# Altium schematic sheet 36.SchDoc
size 594 x 420 mm; Scale: 1:1; Обозначение документа: ГУИР.203719.145 Э3; Номер листа: 28; Общее количество листов: 28
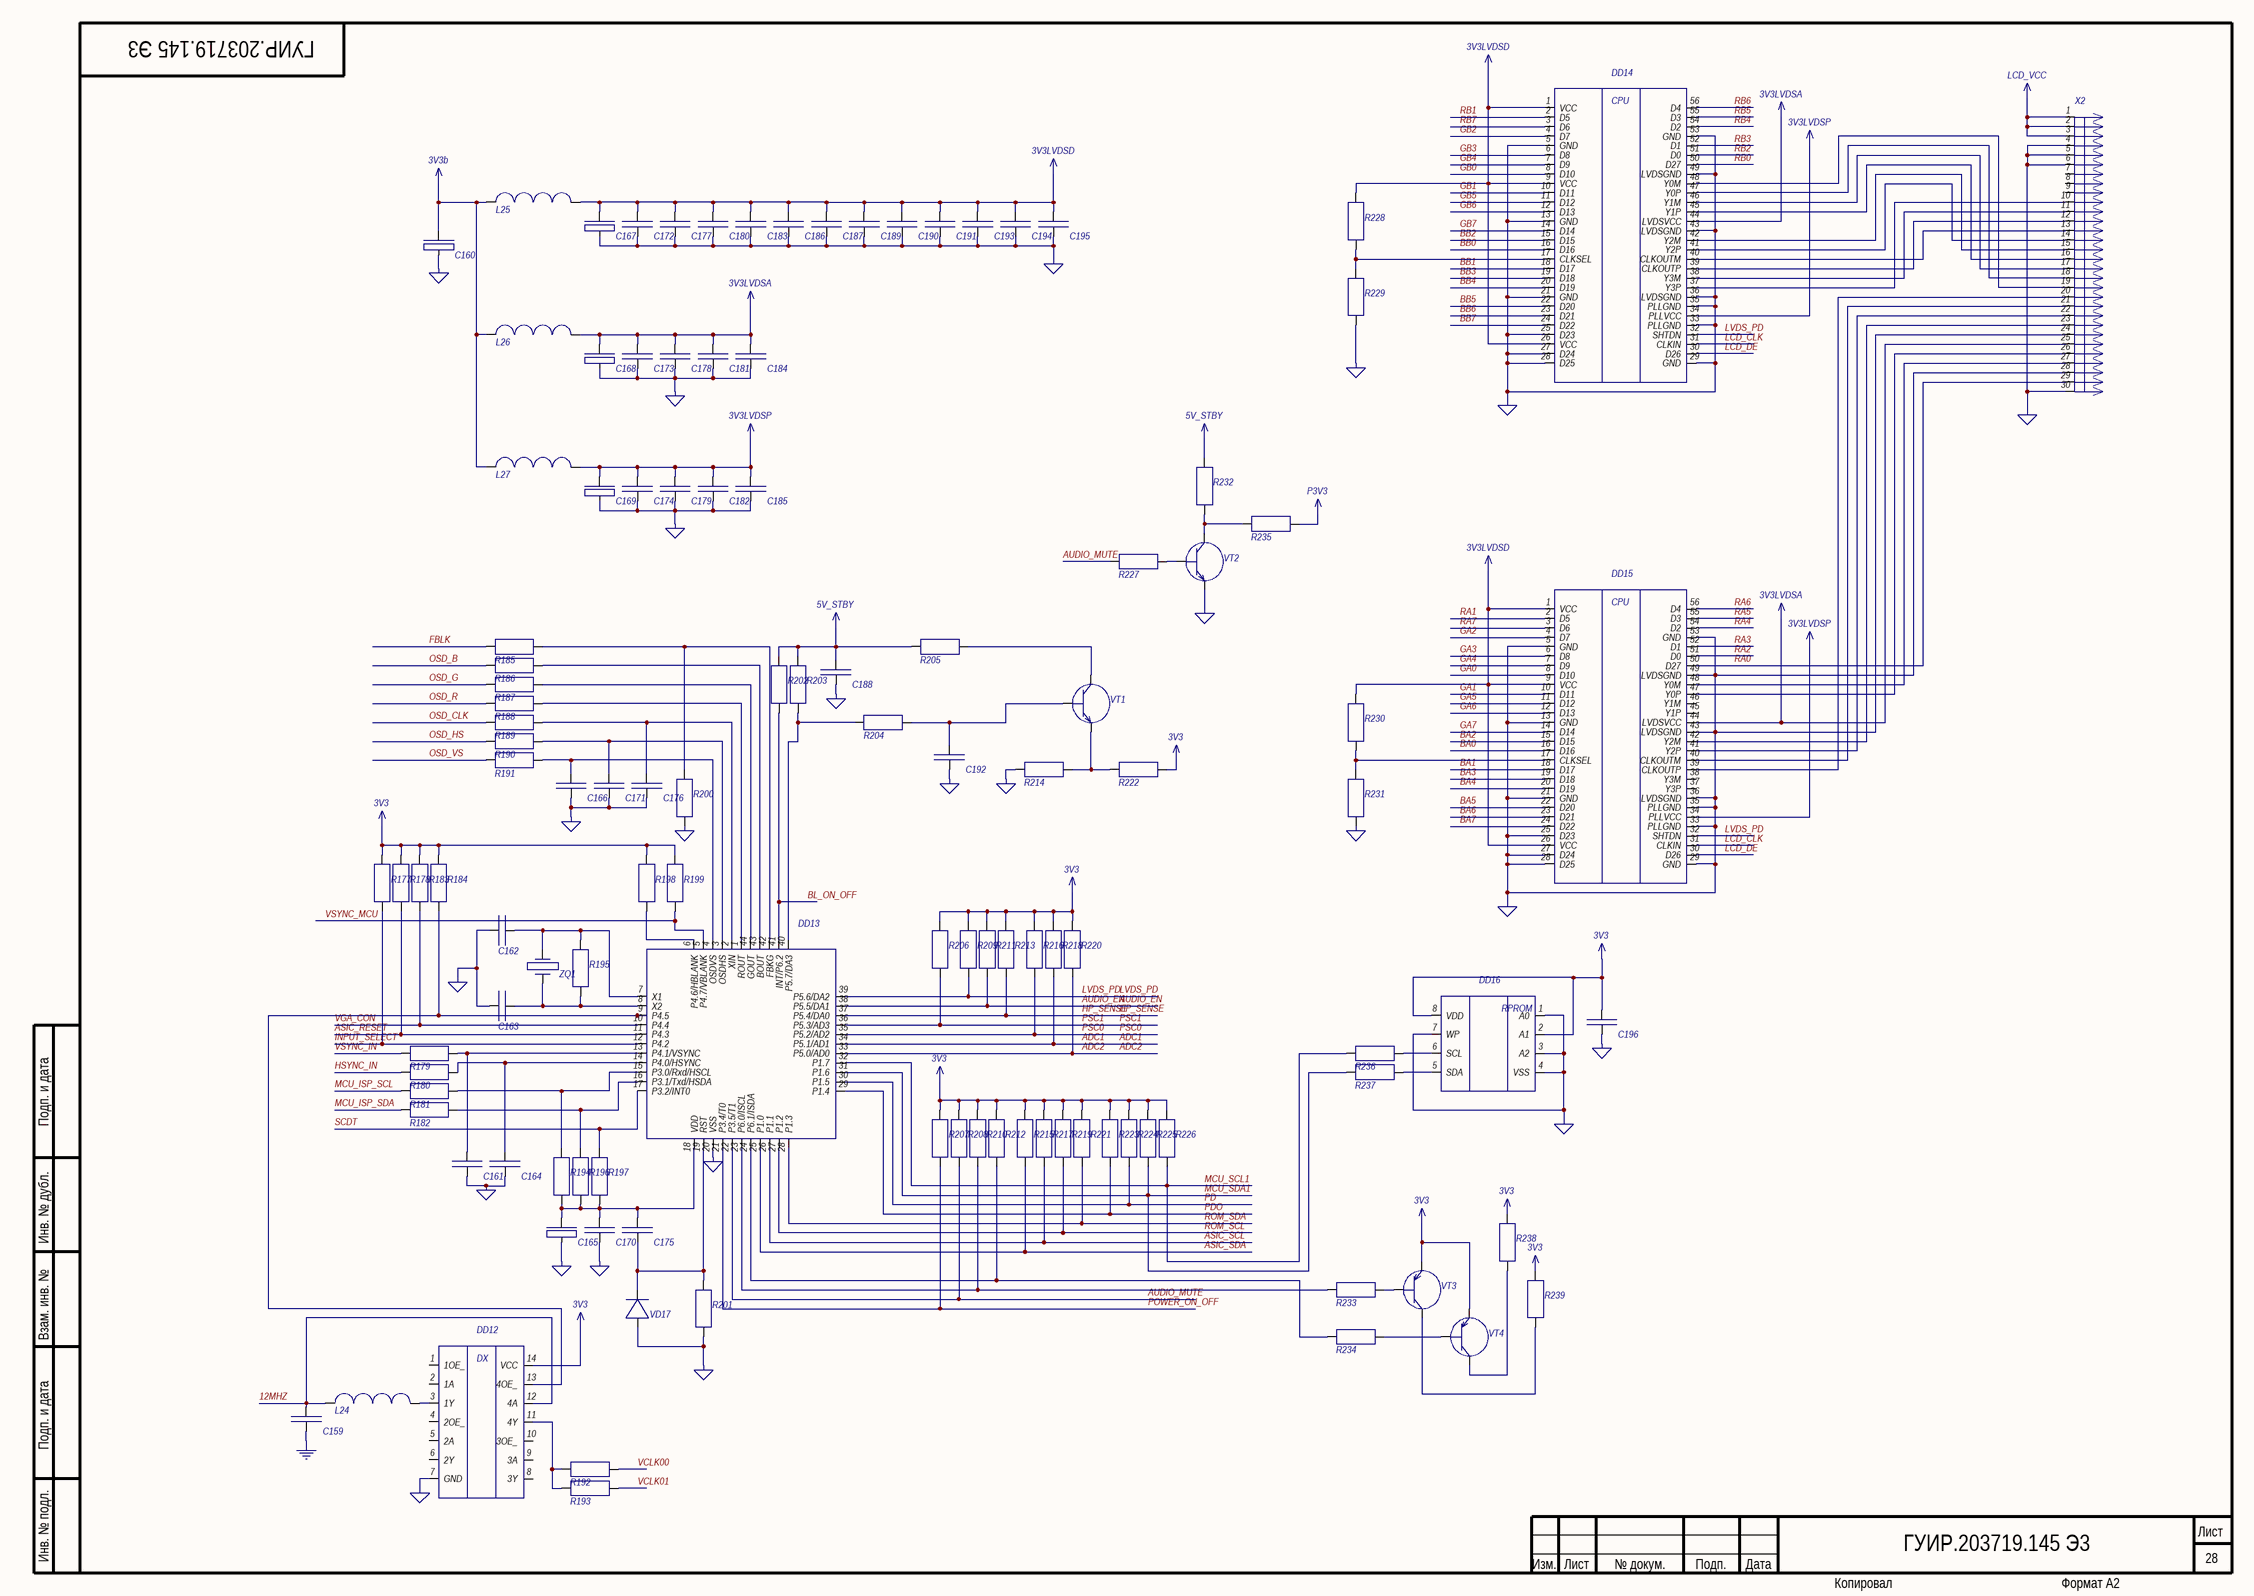
[diagram p0: 36.SchDoc]

## Parts
C159  Capacitor  [cap_electro_13]  (value not drawn)
C160  TuningCapacitor  [Cap_tantal_D]  (value not drawn)
C161  Capacitor  [cap_electro_13]  (value not drawn)
C162  Capacitor  [cap_electro_13]  (value not drawn)
C163  Capacitor  [cap_electro_13]  (value not drawn)
C164  Capacitor  [cap_electro_13]  (value not drawn)
C165  TuningCapacitor  [Cap_tantal_D]  (value not drawn)
C166  Capacitor  [cap_electro_13]  (value not drawn)
C167  TuningCapacitor  [Cap_tantal_D]  (value not drawn)
C168  TuningCapacitor  [Cap_tantal_D]  (value not drawn)
C169  TuningCapacitor  [Cap_tantal_D]  (value not drawn)
C170  Capacitor  [cap_electro_13]  (value not drawn)
C171  Capacitor  [cap_electro_13]  (value not drawn)
C172  Capacitor  [cap_electro_13]  (value not drawn)
C173  Capacitor  [cap_electro_13]  (value not drawn)
C174  Capacitor  [cap_electro_13]  (value not drawn)
C175  Capacitor  [cap_electro_13]  (value not drawn)
C176  Capacitor  [cap_electro_13]  (value not drawn)
C177  Capacitor  [cap_electro_13]  (value not drawn)
C178  Capacitor  [cap_electro_13]  (value not drawn)
C179  Capacitor  [cap_electro_13]  (value not drawn)
C180  Capacitor  [cap_electro_13]  (value not drawn)
C181  Capacitor  [cap_electro_13]  (value not drawn)
C182  Capacitor  [cap_electro_13]  (value not drawn)
C183  Capacitor  [cap_electro_13]  (value not drawn)
C184  Capacitor  [cap_electro_13]  (value not drawn)
C185  Capacitor  [cap_electro_13]  (value not drawn)
C186  Capacitor  [cap_electro_13]  (value not drawn)
C187  Capacitor  [cap_electro_13]  (value not drawn)
C188  Capacitor  [cap_electro_13]  (value not drawn)
C189  Capacitor  [cap_electro_13]  (value not drawn)
C190  Capacitor  [cap_electro_13]  (value not drawn)
C191  Capacitor  [cap_electro_13]  (value not drawn)
C192  Capacitor  [cap_electro_13]  (value not drawn)
C193  Capacitor  [cap_electro_13]  (value not drawn)
C194  Capacitor  [cap_electro_13]  (value not drawn)
C195  Capacitor  [cap_electro_13]  (value not drawn)
C196  Capacitor  [cap_electro_13]  (value not drawn)
DD12  74LCX125  [74LCX125(page12)]  (value not drawn)
DD13  SM0230  [SM0230]  (value not drawn)
DD14  SN75LVDS83  [SN75LVDS83_v2]  (value not drawn)
DD15  SN75LVDS83  [SN75LVDS83_v2]  (value not drawn)
DD16  24LC16  [24Cxx]  (value not drawn)
L24  Inductor  [inductor]  (value not drawn)
L25  Inductor  [inductor]  (value not drawn)
L26  Inductor  [inductor]  (value not drawn)
L27  Inductor  [inductor]  (value not drawn)
R177  Resistor  [R_1206]  (value not drawn)
R178  Resistor  [R_1206]  (value not drawn)
R179  Resistor  [R_1206]  (value not drawn)
R180  Resistor  [R_1206]  (value not drawn)
R181  Resistor  [R_1206]  (value not drawn)
R182  Resistor  [R_1206]  (value not drawn)
R183  Resistor  [R_1206]  (value not drawn)
R184  Resistor  [R_1206]  (value not drawn)
R185  Resistor  [R_1206]  (value not drawn)
R186  Resistor  [R_1206]  (value not drawn)
R187  Resistor  [R_1206]  (value not drawn)
R188  Resistor  [R_1206]  (value not drawn)
R189  Resistor  [R_1206]  (value not drawn)
R190  Resistor  [R_1206]  (value not drawn)
R191  Resistor  [R_1206]  (value not drawn)
R192  Resistor  [R_1206]  (value not drawn)
R193  Resistor  [R_1206]  (value not drawn)
R194  Resistor  [R_1206]  (value not drawn)
R195  Resistor  [R_1206]  (value not drawn)
R196  Resistor  [R_1206]  (value not drawn)
R197  Resistor  [R_1206]  (value not drawn)
R198  Resistor  [R_1206]  (value not drawn)
R199  Resistor  [R_1206]  (value not drawn)
R200  Resistor  [R_1206]  (value not drawn)
R201  Resistor  [R_1206]  (value not drawn)
R202  Resistor  [R_1206]  (value not drawn)
R203  Resistor  [R_1206]  (value not drawn)
R204  Resistor  [R_1206]  (value not drawn)
R205  Resistor  [R_1206]  (value not drawn)
R206  Resistor  [R_1206]  (value not drawn)
R207  Resistor  [R_1206]  (value not drawn)
R208  Resistor  [R_1206]  (value not drawn)
R209  Resistor  [R_1206]  (value not drawn)
R210  Resistor  [R_1206]  (value not drawn)
R211  Resistor  [R_1206]  (value not drawn)
R212  Resistor  [R_1206]  (value not drawn)
R213  Resistor  [R_1206]  (value not drawn)
R214  Resistor  [R_1206]  (value not drawn)
R215  Resistor  [R_1206]  (value not drawn)
R216  Resistor  [R_1206]  (value not drawn)
R217  Resistor  [R_1206]  (value not drawn)
R218  Resistor  [R_1206]  (value not drawn)
R219  Resistor  [R_1206]  (value not drawn)
R220  Resistor  [R_1206]  (value not drawn)
R221  Resistor  [R_1206]  (value not drawn)
R222  Resistor  [R_1206]  (value not drawn)
R223  Resistor  [R_1206]  (value not drawn)
R224  Resistor  [R_1206]  (value not drawn)
R225  Resistor  [R_1206]  (value not drawn)
R226  Resistor  [R_1206]  (value not drawn)
R227  Resistor  [R_1206]  (value not drawn)
R228  Resistor  [R_1206]  (value not drawn)
R229  Resistor  [R_1206]  (value not drawn)
R230  Resistor  [R_1206]  (value not drawn)
R231  Resistor  [R_1206]  (value not drawn)
R232  Resistor  [R_1206]  (value not drawn)
R233  Resistor  [R_1206]  (value not drawn)
R234  Resistor  [R_1206]  (value not drawn)
R235  Resistor  [R_1206]  (value not drawn)
R236  Resistor  [R_1206]  (value not drawn)
R237  Resistor  [R_1206]  (value not drawn)
R238  Resistor  [R_1206]  (value not drawn)
R239  Resistor  [R_1206]  (value not drawn)
VD17  Diode  [zener_diode]  (value not drawn)
VT1  MMBT3904L  [MMBT3904L]  (value not drawn)
VT2  MMBT3904L  [MMBT3904L]  (value not drawn)
VT3  2N3906  [2N3906]  (value not drawn)
VT4  2N3906  [2N3906]  (value not drawn)
X2  FI-SE30P-HF  [FI-SE30P-HF_v2]  (value not drawn)
ZQ1  Crystal  [crystal]  (value not drawn)

## Nets
3V3: C196.1 DD12.14(VCC) DD16.2(A1) DD16.8(VDD) R177.2 R178.2 R183.2 R184.2 R198.2 R199.2 R206.1 R207.1 R208.1 R209.1 R210.1 R211.1 R212.1 R213.1 R215.1 R216.1 R217.1 R218.1 R219.1 R220.1 R221.1 R222.2 R223.1 R224.1 R225.1 R226.1 R238.2 R239.2 VT3.2(Emitter) VT4.2(Emitter)
3V3b: C160.1 L25.1 L26.1 L27.1
3V3LVDSA: C168.1 C173.2 C178.2 C181.2 C184.2 DD14.44(LVDSVCC) DD15.44(LVDSVCC) L26.2 X2.25(RXEIN2-)
3V3LVDSD: C167.1 C172.2 C177.2 C180.2 C183.2 C186.2 C187.2 C189.2 C190.2 C191.2 C193.2 C194.2 C195.2 DD14.1(VCC) DD14.9(VCC) DD14.26(VCC) DD15.1(VCC) DD15.9(VCC) DD15.26(VCC) L25.2 R228.2 R230.2
3V3LVDSP: C169.1 C174.2 C179.2 C182.2 C185.2 DD14.34(PLLVCC) DD15.34(PLLVCC) L27.2
5V_STBY: C188.1 R202.1 R203.1 R205.1 R232.2
GND: C159.2 C160.2 C161.1 C162.2 C163.2 C164.1 C165.2 C166.2 C167.2 C168.2 C169.2 C170.1 C171.2 C172.1 C173.1 C174.1 C176.2 C177.1 C178.1 C179.1 C180.1 C181.1 C182.1 C183.1 C184.1 C185.1 C186.1 C187.1 C188.2 C189.1 C190.1 C191.1 C192.2 C193.1 C194.1 C195.1 C196.2 DD12.7(GND) DD13.20(VSS) DD14.5(GND) DD14.13(GND) DD14.21(GND) DD14.25(D23) DD14.27(D24) DD14.28(D25) DD14.29(GND) DD14.33(PLLGND) DD14.35(PLLGND) DD14.36(LVDSGND) DD14.43(LVDSGND) DD14.49(LVDSGND) DD14.53(GND) DD15.5(GND) DD15.13(GND) DD15.21(GND) DD15.25(D23) DD15.27(D24) DD15.28(D25) DD15.29(GND) DD15.33(PLLGND) DD15.35(PLLGND) DD15.36(LVDSGND) DD15.43(LVDSGND) DD15.49(LVDSGND) DD15.53(GND) DD16.1(A0) DD16.3(A2) DD16.4(VSS) DD16.7(WP) R200.1 R201.1 R214.1 R229.1 R231.1 VD17.1 VT2.2(Emitter) X2.4(GND) X2.5(GND) X2.6(GND) X2.24(RXEIN2+) X2.28(RXEIN0+) X2.30(LVDSGND)
LCD_VCC: X2.1(VIN) X2.2(VIN) X2.3(VIN)
P3V3: R235.2
12MHZ: C159.1 DD12.12(4A) L24.1
ADC1: DD13.34(P5.1/AD1) R218.2
ADC2: DD13.33(P5.0/AD0) R220.2
ASIC_RESET: DD13.11(P4.3) R178.1
ASIC_SCL: DD13.26(P1.1) R217.2
ASIC_SDA: DD13.25(P1.0) R215.2
AUDIO_EN: DD13.38(P5.5/DA1) R211.2
AUDIO_MUTE: DD13.22(P3.5/T1) R208.2 R227.1
BA0: DD15.16(D16)
BA1: DD15.18(D17)
BA2: DD15.15(D15)
BA3: DD15.19(D18)
BA4: DD15.20(D19)
BA5: DD15.22(D20)
BA6: DD15.23(D21)
BA7: DD15.24(D22)
BB0: DD14.16(D16)
BB1: DD14.18(D17)
BB2: DD14.15(D15)
BB3: DD14.19(D18)
BB4: DD14.20(D19)
BB5: DD14.22(D20)
BB6: DD14.23(D21)
BB7: DD14.24(D22)
BL_ON_OFF: DD13.41(INT/P6.2) R202.2
FBLK: R185.2
GA0: DD15.8(D10)
GA1: DD15.10(D11)
GA2: DD15.4(D7)
GA3: DD15.6(D8)
GA4: DD15.7(D9)
GA5: DD15.11(D12)
GA6: DD15.12(D13)
GA7: DD15.14(D14)
GB0: DD14.8(D10)
GB1: DD14.10(D11)
GB2: DD14.4(D7)
GB3: DD14.6(D8)
GB4: DD14.7(D9)
GB5: DD14.11(D12)
GB6: DD14.12(D13)
GB7: DD14.14(D14)
HP_SENSE: DD13.37(P5.4/DA0) R213.2
HSYNC_IN: R180.1
INPUT_SELECT: DD13.12(P4.2) R177.1
LCD_CLK: DD14.31(CLKIN) DD15.31(CLKIN)
LCD_DE: DD14.30(D26) DD15.30(D26)
LVDS_PD: DD13.39(P5.6/DA2) DD14.32(SHTDN) DD15.32(SHTDN) R209.2
MCU_ISP_SCL: R181.1
MCU_ISP_SDA: R182.1
MCU_SCL1: DD13.32(P1.7) R226.2 R236.1
MCU_SDA1: DD13.31(P1.6) R225.2 R237.1
OSD_B: R186.2
OSD_CLK: R189.2
OSD_G: R187.2
OSD_HS: R190.2
OSD_R: R188.2
OSD_VS: R191.2
PD: DD13.30(P1.5) R224.2
PDO: DD13.29(P1.4) R223.2
POWER_ON_OFF: DD13.21(P3.4/T0) R207.2
PSC0: DD13.35(P5.2/AD2) R216.2
PSC1: DD13.36(P5.3/AD3) R206.2
RA0: DD15.50(D27) X2.29(RXEIN0-)
RA1: DD15.2(D5)
RA2: DD15.51(D0)
RA3: DD15.52(D1)
RA4: DD15.54(D2)
RA5: DD15.55(D3)
RA6: DD15.56(D4)
RA7: DD15.3(D6)
RB0: DD14.50(D27)
RB1: DD14.2(D5)
RB2: DD14.51(D0)
RB3: DD14.52(D1)
RB4: DD14.54(D2)
RB5: DD14.55(D3)
RB6: DD14.56(D4)
RB7: DD14.3(D6)
ROM_SCL: DD13.27(P1.2) R219.2
ROM_SDA: DD13.28(P1.3) R221.2
SCDT: DD13.17(P3.2/INT0) R197.2
VCLK00: R192.2
VCLK01: R193.2
VGA_CON: DD13.10(P4.4) R183.1
VSYNC_IN: R179.1
VSYNC_MCU: DD13.5(P4.7/VBLANK) R199.1
NetC161_2: C161.2 DD13.13(P4.1/VSYNC) R179.2
NetC162_1: C162.1 DD13.7(X1) R195.2 ZQ1.2
NetC163_1: C163.1 DD13.8(X2) R195.1 ZQ1.1
NetC164_2: C164.2 DD13.14(P4.0/HSYNC) R180.2
NetC165_1: C165.1 C170.2 C175.2 DD13.18(VDD) R194.1 R196.1 R197.1
NetC166_1: C166.1 DD13.4(OSDVS) R191.1
NetC171_1: C171.1 DD13.3(OSDHS) R190.1
NetC175_1: C175.1 DD13.19(RST) R201.2 VD17.2
NetC176_1: C176.1 DD13.2(XIN) R189.1
NetC192_1: C192.1 R204.2 VT1.1(Base)
NetDD12_3: DD12.3(1Y) L24.2
NetDD12_11: DD12.11(4Y) R192.1 R193.1
NetDD12_13: DD12.13(4OE_) DD13.9(P4.5) R184.1
NetDD13_1: DD13.1(ROUT) R188.1
NetDD13_6: DD13.6(P4.6/HBLANK) R198.1
NetDD13_15: DD13.15(P3.0/Rxd/HSCL) R181.2 R194.2
NetDD13_16: DD13.16(P3.1/Txd/HSDA) R182.2 R196.2
NetDD13_23: DD13.23(P6.0/ISCL) R210.2 R233.1
NetDD13_24: DD13.24(P6.1/ISDA) R212.2 R234.1
NetDD13_40: DD13.40(P5.7/DA3) R203.2 R204.1
NetDD13_42: DD13.42(FBKG) R185.1 R200.2
NetDD13_43: DD13.43(BOUT) R186.1
NetDD13_44: DD13.44(GOUT) R187.1
NetDD14_17: DD14.17(CLKSEL) R228.1 R229.2
NetDD14_37: DD14.37(Y3P) X2.10(RXOIN3+)
NetDD14_38: DD14.38(Y3M) X2.11(RXOIN3-)
NetDD14_39: DD14.39(CLKOUTP) X2.12(RXOCLKIN+)
NetDD14_40: DD14.40(CLKOUTM) X2.13(RXOCLKIN-)
NetDD14_41: DD14.41(Y2P) X2.14(RXOIN2+)
NetDD14_42: DD14.42(Y2M) X2.15(RXOIN2-)
NetDD14_45: DD14.45(Y1P) X2.16(RXOIN1+)
NetDD14_46: DD14.46(Y1M) X2.17(RXOIN1-)
NetDD14_47: DD14.47(Y0P) X2.18(RXOIN0+)
NetDD14_48: DD14.48(Y0M) X2.19(RXOIN0-)
NetDD15_17: DD15.17(CLKSEL) R230.1 R231.2
NetDD15_39: DD15.39(CLKOUTP) X2.20(RXEIN3+)
NetDD15_40: DD15.40(CLKOUTM) X2.21(RXEIN3-)
NetDD15_41: DD15.41(Y2P) X2.22(RXECLKIN+)
NetDD15_42: DD15.42(Y2M) X2.23(RXECLKIN-)
NetDD15_47: DD15.47(Y0P) X2.26(RXEIN1+)
NetDD15_48: DD15.48(Y0M) X2.27(RXEIN1-)
NetDD16_5: DD16.5(SDA) R237.2
NetDD16_6: DD16.6(SCL) R236.2
NetR205_2: R205.2 VT1.3(Collector)
NetR214_2: R214.2 R222.1 VT1.2(Emitter)
NetR227_2: R227.2 VT2.1(Base)
NetR232_1: R232.1 R235.1 VT2.3(Collector)
NetR233_2: R233.2 VT3.1(Base)
NetR234_2: R234.2 VT4.1(Base)
NetR238_1: R238.1 VT4.3(Collector)
NetR239_1: R239.1 VT3.3(Collector)

Not connected (* = marked no-connect by the designer): DD12 1(1OE_) 2(1A) 4(2OE_) 5(2A) 6(2Y) 8(3Y) 9(3A) 10(3OE_); DD15 37(Y3P) 38(Y3M) 45(Y1P) 46(Y1M); X2 7(SELLVDS) 8(VcontIN) 9(DGND)

## Notes on the sheet
- Подп. и дата
- Инв. № дубл.
- Взам. инв. №
- Инв. № подл.
- Изм.
- Лист
- № докум.
- Подп.
- Дата
- Копировал
- Формат А2
- (in symbol 24LC16) RPROM
- (in symbol 74LCX125) DX
- (in symbol SN75LVDS83) CPU